# EAGLE design OpenSoundPhoton (EAGLE 7.5.0)
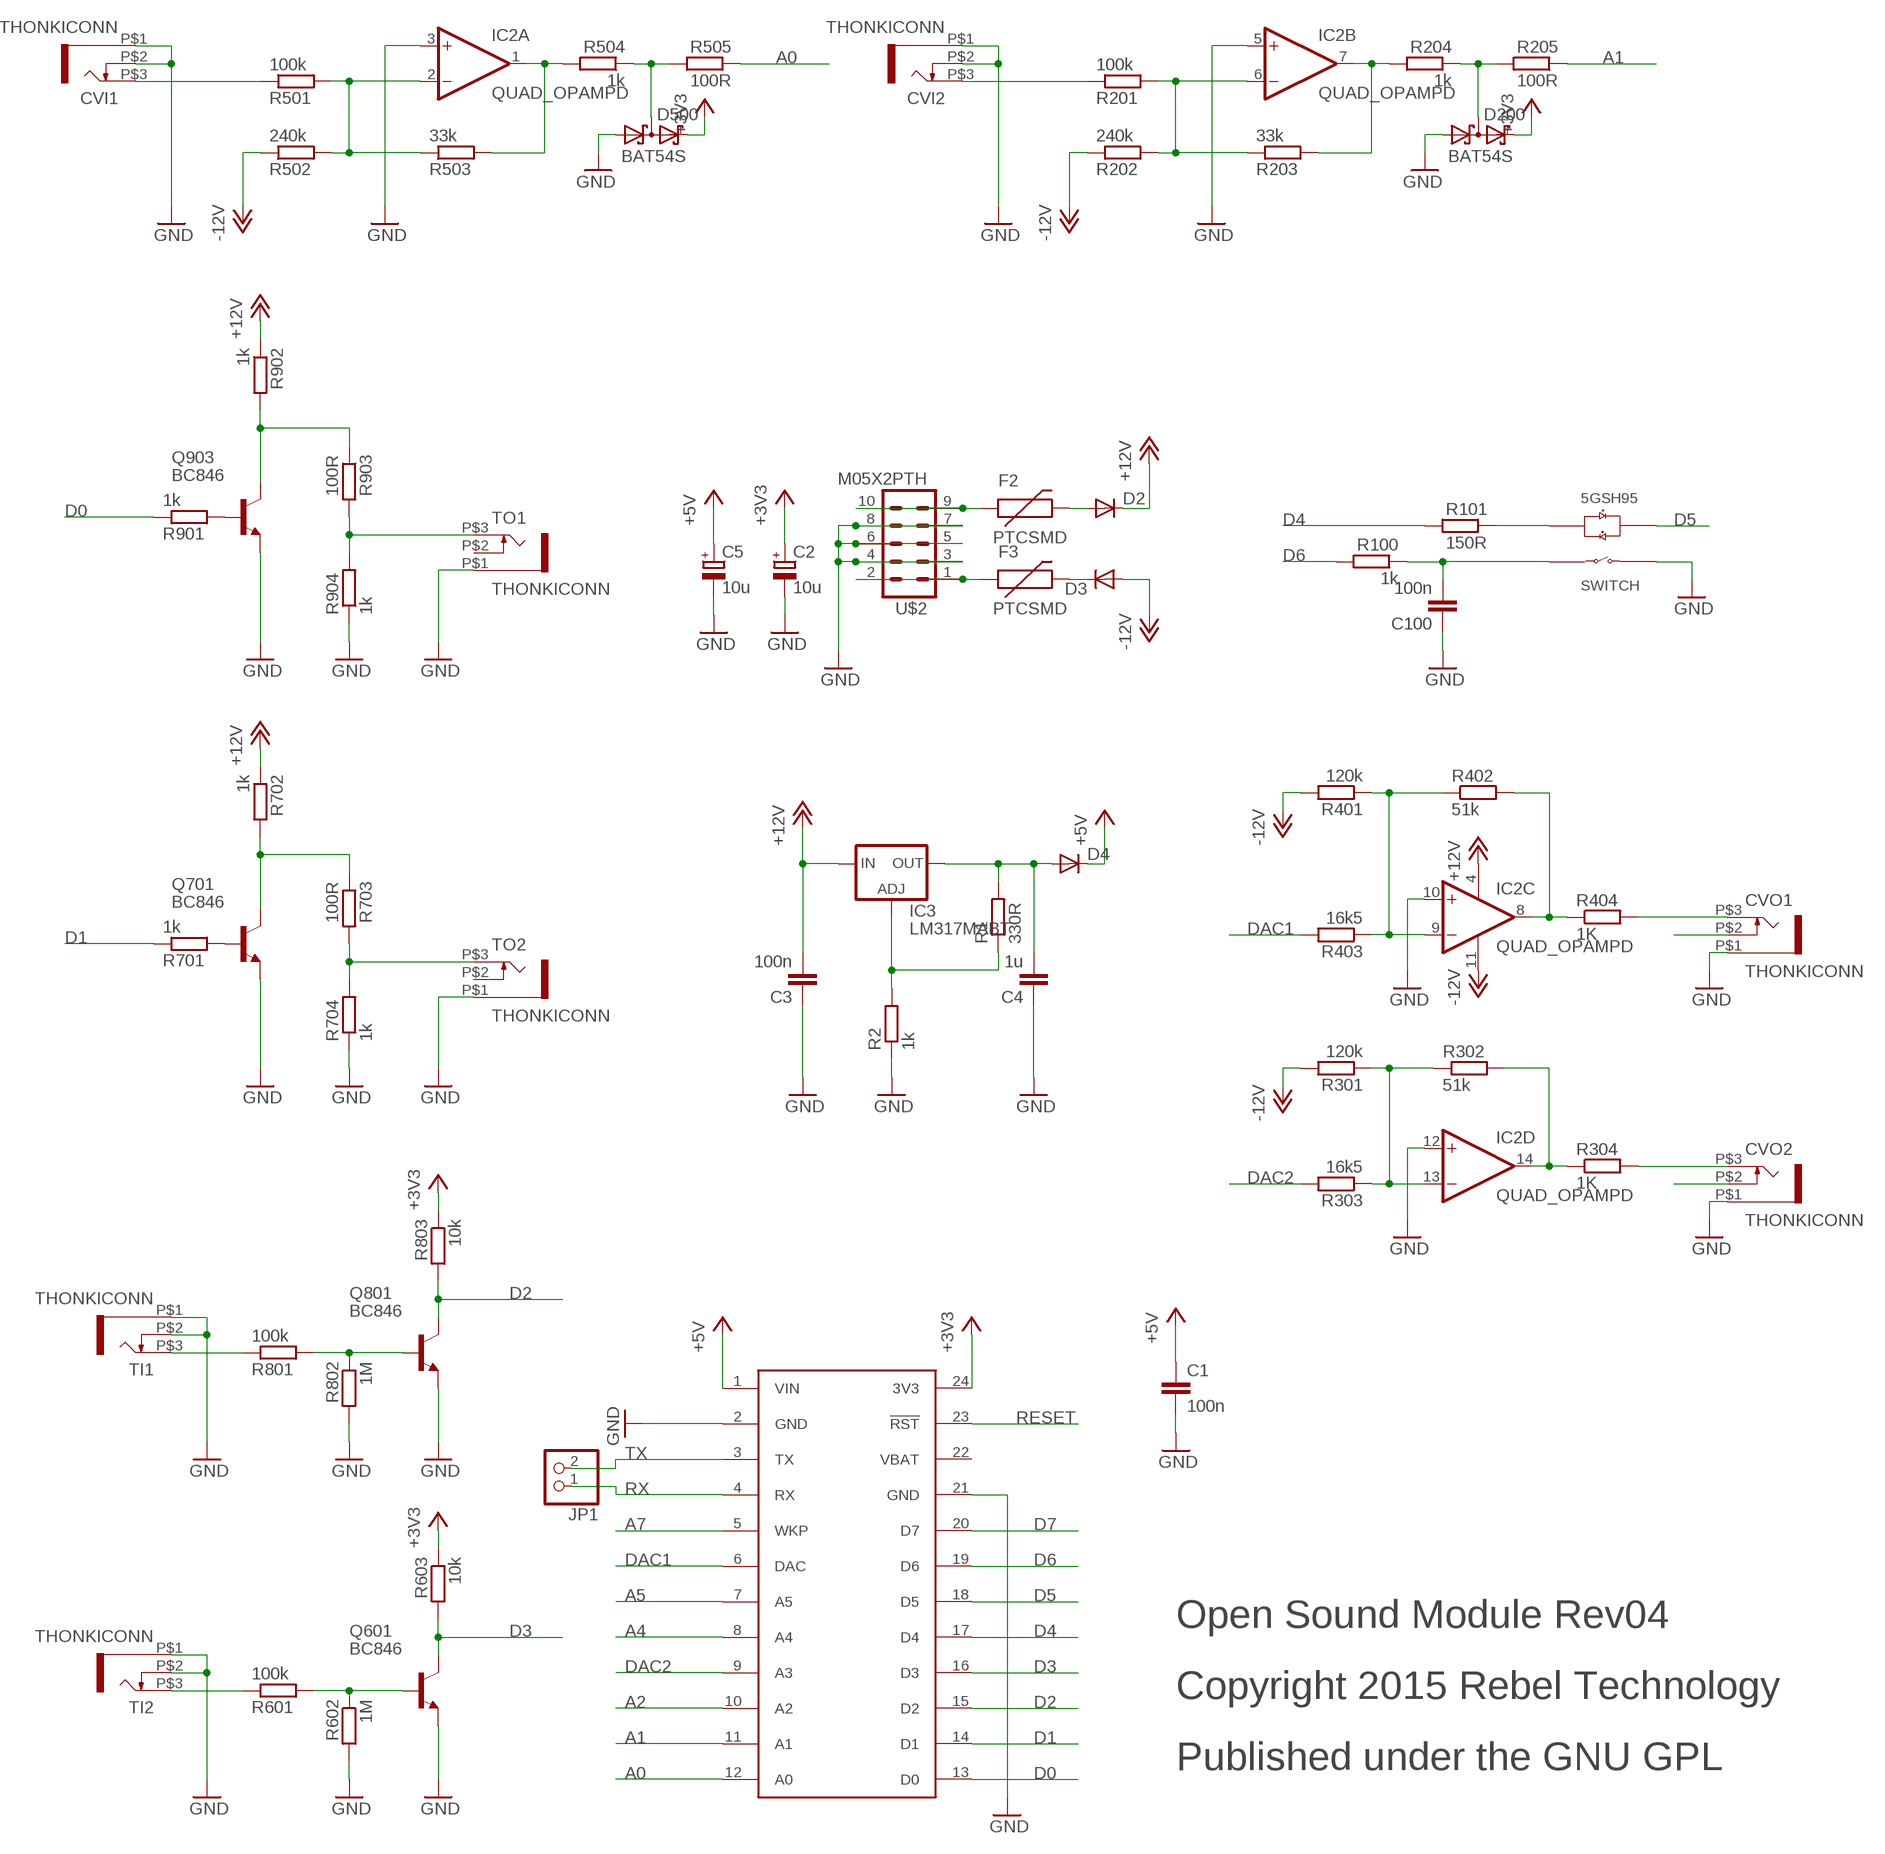
[diagram p0: schematic, sheet 1]

## Parts
C1  100n  C-EUC0603  [C0603]
C2  10u  CPOL-EUSANYO_SMD_A5  [SANYO-OSCON_SMD_A5]
C3  100n  C-EUC0603  [C0603]
C4  1u  C-EUC0603  [C0603]
C5  10u  CPOL-EUSANYO_SMD_A5  [SANYO-OSCON_SMD_A5]
C100  100n  C-EUC0603  [C0603]
CVI1  THONKICONN  [THONKICONN]
CVI2  THONKICONN  [THONKICONN]
CVO1  THONKICONN  [THONKICONN]
CVO2  THONKICONN  [THONKICONN]
D2  DIODESMA  [SMA-DIODE]
D3  DIODESMA  [SMA-DIODE]
D4  DIODESMA  [SMA-DIODE]
D200  BAT54S  [SOT23]
D500  BAT54S  [SOT23]
F2  PTCSMD  [PTC-1206]
F3  PTCSMD  [PTC-1206]
IC2  QUAD_OPAMPD  [SO14]
IC3  LM317MABT  [TO220L1]
JP1  PINHD-1X2  [1X02]
Q601  BC846  [SOT23]
Q701  BC846  [SOT23]
Q801  BC846  [SOT23]
Q903  BC846  [SOT23]
R1  330R  R-EU_0603  [0603]
R2  1k  R-EU_0603  [0603]
R100  1k  R-EU_0603  [0603]
R101  150R  R-EU_0603  [0603]
R201  100k  R-EU_0603  [0603]
R202  240k  R-EU_0603  [0603]
R203  33k  R-EU_0603  [0603]
R204  1k  R-EU_0603  [0603]
R205  100R  R-EU_0603  [0603]
R301  120k  R-EU_0603  [0603]
R302  51k  R-EU_0603  [0603]
R303  16k5  R-EU_0603  [0603]
R304  1K  R-EU_0603  [0603]
R401  120k  R-EU_0603  [0603]
R402  51k  R-EU_0603  [0603]
R403  16k5  R-EU_0603  [0603]
R404  1K  R-EU_0603  [0603]
R501  100k  R-EU_0603  [0603]
R502  240k  R-EU_0603  [0603]
R503  33k  R-EU_0603  [0603]
R504  1k  R-EU_0603  [0603]
R505  100R  R-EU_0603  [0603]
R601  100k  R-EU_0603  [0603]
R602  1M  R-EU_0603  [0603]
R603  10k  R-EU_0603  [0603]
R701  1k  R-EU_0603  [0603]
R702  1k  R-EU_0603  [0603]
R703  100R  R-EU_0603  [0603]
R704  1k  R-EU_0603  [0603]
R801  100k  R-EU_0603  [0603]
R802  1M  R-EU_0603  [0603]
R803  10k  R-EU_0603  [0603]
R901  1k  R-EU_0603  [0603]
R902  1k  R-EU_0603  [0603]
R903  100R  R-EU_0603  [0603]
R904  1k  R-EU_0603  [0603]
SPARK  SPARK_CORE  SPARK_CORECORE  [SPARK_CORE]
TI1  THONKICONN  [THONKICONN]
TI2  THONKICONN  [THONKICONN]
TO1  THONKICONN  [THONKICONN]
TO2  THONKICONN  [THONKICONN]
U$1  5GTH9  [5GTH9]
U$2  M05X2PTH  [AVR_ICSP]

## Nets
+3V3: C2.+ D200.2(C2) D500.2(C2) R603.1 R803.1 SPARK.24(3V3)
+5V: C1.1 C5.+ D4.C SPARK.1(VIN)
+12V: C3.2 D2.C IC2.4(P:V+) IC3.3(IN) R702.1 R902.1
-12V: D3.A IC2.11(P:V-) R202.1 R301.2 R401.2 R502.1
A0: R505.1 SPARK.12(A0)
A1: R205.1 SPARK.11(A1)
A2: SPARK.10(A2)
A4: SPARK.8(A4)
A5: SPARK.7(A5)
A7: SPARK.5(WKP)
D0: R901.1 SPARK.13(D0)
D1: R701.1 SPARK.14(D1)
D2: Q801.3(C) R803.2 SPARK.15(D2)
D3: Q601.3(C) R603.2 SPARK.16(D3)
D4: R101.2 SPARK.17(D4)
D5: SPARK.18(D5) U$1.+3(LED_R+)
D6: R100.2 SPARK.19(D6)
D7: SPARK.20(D7)
DAC1: R403.2 SPARK.6(DAC)
DAC2: R303.2 SPARK.9(A3)
GND: C1.2 C2.- C3.1 C4.1 C5.- C100.1 CVI1.P$1 CVI1.P$2 CVI2.P$1 CVI2.P$2 CVO1.P$1 CVO2.P$1 D200.1(A1) D500.1(A1) IC2.3(A:+IN) IC2.5(B:+IN) IC2.10(C:+IN) IC2.12(D:+IN) Q601.2(E) Q701.2(E) Q801.2(E) Q903.2(E) R2.1 R602.2 R704.1 R802.2 R904.1 SPARK.2(GND) SPARK.21(GND) TI1.P$1 TI1.P$2 TI2.P$1 TI2.P$2 TO1.P$1 TO2.P$1 U$1.1(SWITCH_B) U$2.3 U$2.4 U$2.5 U$2.6 U$2.7 U$2.8
N$1: R703.2 R704.2 TO2.P$3
N$2: Q903.1(B) R901.2
N$3: IC2.14(D:OUT) R302.2 R304.1
N$4: Q903.3(C) R902.2 R903.1
N$5: R903.2 R904.2 TO1.P$3
N$6: F3.1 U$2.1 U$2.2
N$7: IC2.8(C:OUT) R402.2 R404.1
N$8: CVO1.P$2
N$9: Q801.1(B) R801.2 R802.1
N$10: R801.1 TI1.P$3
N$11: CVI1.P$3 R501.1
N$13: IC2.9(C:-IN) R401.1 R402.1 R403.1
N$14: IC2.2(A:-IN) R501.2 R502.2 R503.1
N$15: IC2.13(D:-IN) R301.1 R302.1 R303.1
N$16: D500.3(C1A2) R504.1 R505.2
N$17: IC2.1(A:OUT) R503.2 R504.2
N$18: CVI2.P$3 R201.1
N$19: IC3.1(ADJ) R1.1 R2.2
N$20: IC2.6(B:-IN) R201.2 R202.2 R203.1
N$21: C4.2 D4.A IC3.2(OUT) R1.2
N$22: IC2.7(B:OUT) R203.2 R204.2
N$23: R601.1 TI2.P$3
N$24: D200.3(C1A2) R204.1 R205.2
N$25: D3.C F3.2
N$26: D2.A F2.2
N$27: Q601.1(B) R601.2 R602.1
N$28: R101.1 U$1.-2(LED_G+)
N$29: CVO2.P$2
N$31: CVO1.P$3 R404.2
N$32: CVO2.P$3 R304.2
N$34: Q701.1(B) R701.2
N$38: Q701.3(C) R702.2 R703.1
N$45: F2.1 U$2.9 U$2.10
RESET: SPARK.23(!RST)
RX: JP1.1 SPARK.4(RX)
SWITCH_A: C100.2 R100.1 U$1.4(SWITCH_A)
TX: JP1.2 SPARK.3(TX)
Unconnected: TO1.P$2 TO2.P$2

## Notes on the sheet
- Open Sound Module Rev04
- Copyright 2015 Rebel Technology
- Published under the GNU GPL

## Power pins joined to a net without a drawn wire
VBAT: SPARK.22(VBAT)

## Library data of the parts
C1 = resistor:C-EU: CAPACITOR, European symbol
C2 C5 = rcl:CPOL-EU: POLARIZED CAPACITOR, European symbol
C3 C4 C100 = rcl:C-EU: CAPACITOR, European symbol
CVI1 CVI2 CVO1 CVO2 TI1 TI2 TO1 TO2 = Rebel:THONKICONN
D2-D4 = SparkFun:DIODE: Diode These are standard reverse protection diodes and small signal diodes. SMA package can handle up to about 1A. SOD-323 can handle about 200mA. What the SOD-323 package when ordering, there are some mfgs out there that are 5-pin packages.
D200 D500 = diode:BAT54S: Schottky Diodes Pin connection corrected 2011-05-04 Source: Fairchild .. BAT54.pdf
F2 F3 = SparkFun:PTC: Resettable Fuse PTC Resettable Fuse. Spark Fun Electronics SKU : COM-08357
IC2 = adafruit:QUAD_OPAMP: OP AMP Standard quad package
IC3 = v-reg:LM317?*: 500 mA Adjustable Output Positive Voltage Regulator Source: http://www.onsemi.co.jp .. LM317M-D.PDF
JP1 = pinhead:PINHD-1X2: PIN HEADER
Q601 Q701 Q801 Q903 = transistor:BC846: NPN TRANSISTOR
R1 R2 R100 R101 R201-R205 R301-R304 R401-R404 R501-R505 R601-R603 R701-R704 R801-R803 R901-R904 = Rebel:R-EU_: RESISTOR, European symbol
SPARK = Spark:SPARK_CORE
U$1 = SWITCH-5GTH9:5GTH9
U$2 = SparkFun-Connectors:M05X2: Header 5x2 Standard 10-pin dual row 0.1" header. Commonly used with AVR-ISP. Use with Spark Fun Electronics SKU: PRT-00778

## Board
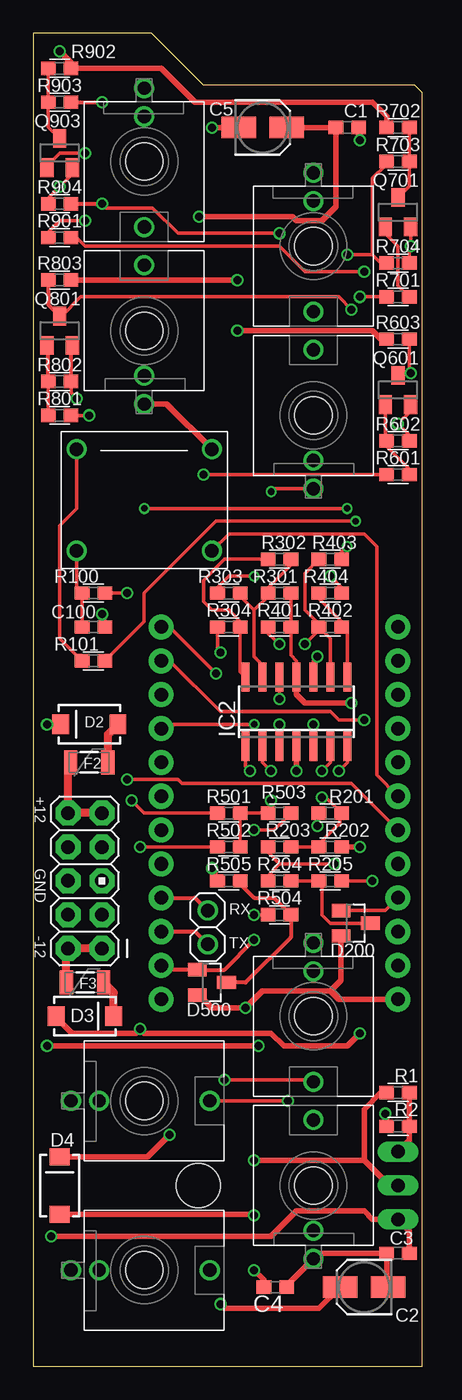
[diagram p1: board, top side]
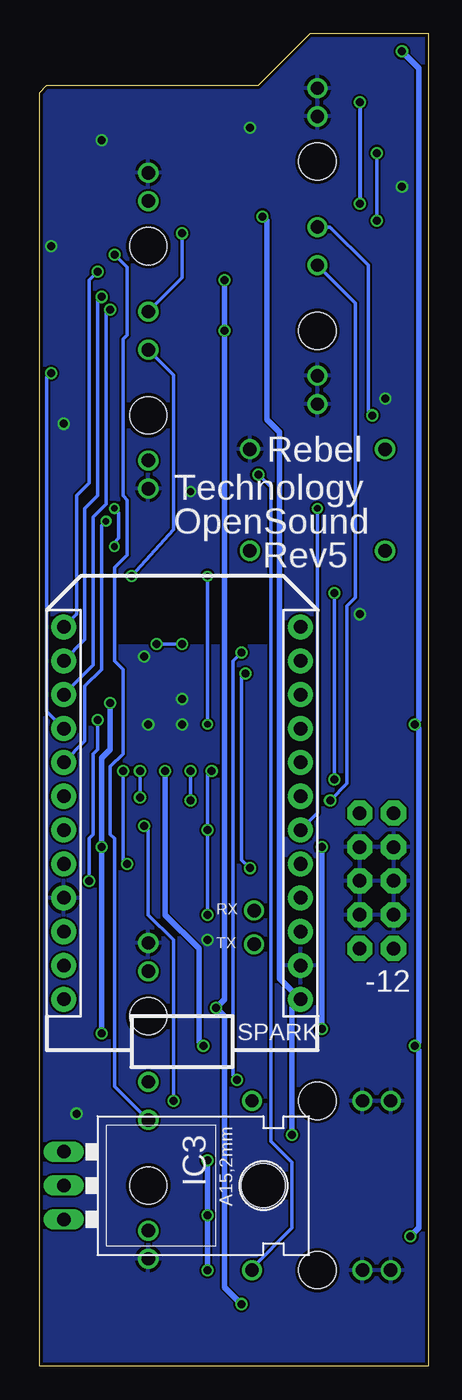
[diagram p2: board, bottom side, seen from below]

Size 29.2 x 100 mm. Coordinates in mm from the lower left corner, seen from the top.
Outline: 29.2,0 29.2,95.55 28.65,96.1 12.77,96.1 8.87,100 0,100 0,0 29.2,0
Copper layers (1*16): Top 0.035mm / dielectric 1.5mm / Bottom 0.035mm
Design rules "Fusion_eagle_rule_v1.1": minimum track width 6mil, minimum drill 12mil, track to track 6mil, track to pad 6mil, pad to pad 6mil, via to via 6mil, smd to smd 0mil, copper to edge 10mil, drill to drill 10mil, minimum pad ring 10mil, minimum via ring 6mil, stop-mask expansion 2mil, vias tented up to drill 100mil, thermal gap 10mil

### Footprints (pad centres in the part's own frame; a part is rotated, then mirrored left to right if it is on the bottom)
C0603 = smd 1.1 x 1: 1 -0.85,0; 2 0.85,0
SANYO-OSCON_SMD_A5 = smd 2.6 x 1.6: + 1.8,0; - -1.8,0
THONKICONN = drill 1: P$1 0,-5.5; P$2 0,-3.38; P$3 0,4.92 | hole 2.8: 0,0
SMA-DIODE = smd 1.27 x 1.47: A -2.15,0; C 2.15,0
SOT23 = smd 1 x 1.4: 1 -0.95,-1.1; 2 0.95,-1.1; 3 0,1.1
PTC-1206 = smd 1 x 1.8: 1 -1.4,0; 2 1.4,0
SO14 = smd 0.6 x 2.2: 1 -3.81,-2.6; 2 -2.54,-2.6; 3 -1.27,-2.6; 4 0,-2.6; 5 1.27,-2.6; 6 2.54,-2.6; 7 3.81,-2.6; 8 3.81,2.6; 9 2.54,2.6; 10 1.27,2.6; 11 0,2.6; 12 -1.27,2.6; 13 -2.54,2.6; 14 -3.81,2.6
TO220L1 = drill 1.016 long: 1 -2.54,-3.81; 2 0,-3.81; 3 2.54,-3.81 | hole 3.302: 0,11.176
1X02 = drill 1.016: 1 -1.27,0; 2 1.27,0
0603 = smd 1.1 x 1: 1 -0.85,0; 2 0.85,0
SPARK_CORE = drill 1.016 pad 1.88: 1 -8.89,13.97; 2 -8.89,11.43; 3 -8.89,8.89; 4 -8.89,6.35; 5 -8.89,3.81; 6 -8.89,1.27; 7 -8.89,-1.27; 8 -8.89,-3.81; 9 -8.89,-6.35; 10 -8.89,-8.89; 11 -8.89,-11.43; 12 -8.89,-13.97; 13 8.89,-13.97; 14 8.89,-11.43; 15 8.89,-8.89; 16 8.89,-6.35; 17 8.89,-3.81; 18 8.89,-1.27; 19 8.89,1.27; 20 8.89,3.81; 21 8.89,6.35; 22 8.89,8.89; 23 8.89,11.43; 24 8.89,13.97
5GTH9 = drill 1: 1 5.08,3.81; 4 -5.08,-3.81; +3 5.08,-3.81; -2 -5.08,3.81
AVR_ICSP = drill 1.016 pad 1.88 octagon: 1 -1.27,5.08; 2 1.27,5.08; 3 -1.27,2.54; 4 1.27,2.54; 5 -1.27,0; 6 1.27,0; 7 -1.27,-2.54; 8 1.27,-2.54; 9 -1.27,-5.08; 10 1.27,-5.08

### Placement (x,y rotation side)
C1  23.57,92.93 0 top
C2  24.84,5.93 180 top
C3  27.38,8.47 0 top
C4  18.17,5.93 180 top
C5  17.22,92.93 0 top
C100  4.52,55.46 180 top
CVI1  8.33,77.69 0 top
CVI2  8.33,19.9 270 top
CVO1  21.03,71.34 0 top
CVO2  21.03,26.25 180 top
D2  4.2,48.16 180 top
D3  3.88,26.25 0 top
D4  1.98,13.55 90 top
D200  24.2,33.24 270 top
D500  13.41,28.79 270 top
F2  4.2,45.3 0 top
F3  3.88,28.79 0 top
IC2  19.76,49.11 0 top
IC3  23.57,13.55 270 bottom
JP1  13.09,32.92 270 top
Q601  27.38,73.24 0 top
Q701  27.38,86.58 0 top
Q801  1.98,77.69 0 top
Q903  1.98,91.02 0 top
R1  27.38,20.54 180 top
R2  27.38,18 0 top
R100  4.52,58 0 top
R101  4.52,52.92 0 top
R201  22.3,41.49 0 top
R202  22.3,38.95 180 top
R203  18.49,38.95 180 top
R204  18.49,36.41 180 top
R205  22.3,36.41 180 top
R301  18.49,58 0 top
R302  18.49,60.54 180 top
R303  14.68,58 180 top
R304  14.68,55.46 180 top
R401  18.49,55.46 0 top
R402  22.3,55.46 0 top
R403  22.3,60.54 0 top
R404  22.3,58 0 top
R501  14.68,41.49 0 top
R502  14.68,38.95 0 top
R503  18.49,41.49 0 top
R504  18.49,33.87 180 top
R505  14.68,36.41 0 top
R601  27.38,66.89 0 top
R602  27.38,69.43 0 top
R603  27.38,77.05 0 top
R701  27.38,80.23 0 top
R702  27.38,92.93 0 top
R703  27.38,90.39 180 top
R704  27.38,82.77 180 top
R801  1.98,71.34 180 top
R802  1.98,73.88 0 top
R803  1.98,81.5 180 top
R901  1.98,84.67 180 top
R902  1.98,97.37 180 top
R903  1.98,94.83 0 top
R904  1.98,87.21 0 top
SPARK  18.49,41.49 180 bottom
TI1  8.33,90.39 180 top
TI2  8.33,7.2 270 top
TO1  21.03,84.04 180 top
TO2  21.03,13.55 0 top
U$1  8.33,64.99 0 top
U$2  3.88,36.41 180 top

### Tracks (layer width: path | path; a pad name or v marks a point on that pad's centre or on a via)
+3V3  (via drill 0.6)
  Top 0.406: R803.1 v15.31,81.5 | v14.04,4.66 14.36,4.34 21.45,4.34 C2.+ | R603.1 26.11,77.05 25.47,77.69 v15.31,77.69 | D200.2 23.1,28.96 22.3,28.16 | SPARK.24 22.93,27.52 22.3,28.16 | 22.3,28.16 17.22,28.16 v15.95,26.89 13.41,26.89 12.45,27.84 D500.2
  Bottom 0.406: v15.31,81.5 v15.31,77.69 15.31,27.52 v15.95,26.89 15.31,26.25 15.31,5.93 v14.04,4.66
+5V  (via drill 0.6)
  Top 0.406: D4.C 8.57,15.7 v10.23,17.36 | v12.45,86.26 19.44,86.26 19.76,85.94 21.66,85.94 22.72,87 C1.1 C5.+
  Bottom 0.406: v10.23,17.36 10.23,26.89 SPARK.1 11.19,29.11 11.19,70.07 12.14,71.02 12.14,85.94 v12.45,86.26
+12V  (via drill 0.6)
  Top 0.406: v1.98,98.64 2.61,98.01 | 2.61,98.01 2.61,97.59 R902.1 | R902.1 2.83,97.79 2.61,98.01 | v1.34,9.74 17.85,9.74 19.76,11.65 24.84,11.65 25.47,11.01 IC3.3 28.23,10.16 C3.2 | IC2.4 v19.76,44.67 | v16.9,24.03 v1.02,24.03 | D2.C v1.02,48.16 | R702.1 26.53,93.78 25.47,94.83 12.14,94.83 9.6,97.37 R902.1
  Bottom 0.406: v1.98,98.64 0.71,97.37 0.71,48.48 v1.02,48.16 0.71,47.84 0.71,24.35 v1.02,24.03 0.71,23.71 0.71,10.38 v1.34,9.74 | v19.76,44.67 19.76,33.87 17.22,31.33 17.22,24.35 v16.9,24.03
-12V  (via drill 0.6)
  Top 0.254: R301.2 R401.2 19.34,53.34 19.76,52.92 IC2.11 | R502.1 v8.01,38.95
  Top 0.406: IC2.11 19.76,50.38 20.39,49.75 v23.89,49.75 | v24.52,38.95 R202.1 | v24.52,24.98 23.57,24.03 18.8,24.03 17.85,24.98 8.33,24.98 v8.01,25.3 7.69,24.98 2.93,24.98 1.73,26.18 D3.A
  Bottom 0.406: v23.89,49.75 23.89,46.25 24.52,45.62 v24.52,38.95 v24.52,24.98 | v8.01,38.95 v8.01,25.3
A0  (via drill 0.6)
  Top 0.254: SPARK.12 10.23,55.46 v13.72,51.97 | v13.41,37.36 13.72,37.05 13.72,36.51 R505.1
  Bottom 0.254: v13.72,51.97 14.04,51.65 14.04,38 v13.41,37.36
A1  (via drill 0.6)
  Top 0.254: SPARK.11 10.23,52.92 14.04,49.11 22.3,49.11 22.93,48.48 v24.84,48.48 | v25.47,36.41 R205.1
  Bottom 0.254: v24.84,48.48 24.84,46.25 25.16,45.94 25.16,39.9 25.47,39.59 v25.47,36.41
D0  (via drill 0.6)
  Top 0.254: R901.1 3.25,84.67 3.88,84.04 18.49,84.04 20.39,82.13 v24.84,82.13
  Bottom 0.254: v24.84,82.13 25.47,81.5 25.47,66.26 26.43,65.3 26.43,56.41 SPARK.13
D1  (via drill 0.6)
  Top 0.254: R701.1 v24.52,80.23
  Bottom 0.254: SPARK.14 25.79,54.51 25.79,64.35 24.84,65.3 24.84,79.91 v24.52,80.23
D2  (via drill 0.6)
  Top 0.254: Q801.3 2.13,78.79 3.56,80.23 22.93,80.23 v23.89,79.27
  Top 0.305: R803.2 1.13,79.64 Q801.3
  Bottom 0.254: v23.89,79.27 24.2,78.96 24.2,64.67 25.16,63.72 25.16,52.6 SPARK.15
D3  (via drill 0.6)
  Top 0.254: Q601.3 27.55,74.51 v28.33,74.51 28.23,74.61 R603.2
  Bottom 0.254: SPARK.16 28.65,49.11 28.65,74.19 v28.33,74.51
D4  (via drill 0.5)
  Top 0.254: v24.2,63.4 13.72,63.4 8.33,58 8.33,55.88 R101.2
  Bottom 0.254: SPARK.17 25.79,46.89 25.79,51.02 24.52,52.29 24.52,63.08 v24.2,63.4
D5
  Top 0.254: SPARK.18 25.79,44.35 25.79,61.49 24.84,62.45 14.68,62.45 U$1.+3
D6  (via drill 0.6)
  Top 0.254: SPARK.19 23.89,43.71 11.19,43.71 10.87,44.03 v7.06,44.03 | v7.06,58 R100.2
  Bottom 0.254: v7.06,44.03 v7.06,58
DAC1  (via drill 0.5)
  Top 0.254: R403.2 23.15,61.07 v23.57,61.49 | v23.57,64.35 v8.33,64.35
  Bottom 0.254: v23.57,61.49 23.57,61.81 23.25,62.13 23.25,64.03 v23.57,64.35 | v8.33,64.35 8.33,41.49 SPARK.6
DAC2  (via drill 0.5)
  Top 0.254: R303.2 13.83,58.42 14.68,59.27 v16.58,59.27 | v16.58,48.16 9.92,48.16 SPARK.9
  Bottom 0.254: v16.58,59.27 v16.58,48.16
GND  (via drill 0.5, 0.6)
  Top 0.254: R802.2 2.83,73.03 v3.25,72.61 | 28.33,82.87 R704.1 28.23,83.93 v28.33,84.04 28.33,84.36 Q701.2 | Q601.2 28.33,71.65 v27.38,70.7 28.23,69.85 R602.2 | Q903.2 2.93,89.43 v1.98,88.48 1.13,87.63 R904.1 | D200.1 26.43,34.19 SPARK.21 | C100.1 5.37,56.2 v5.15,56.41 | IC2.10 21.03,52.92 v21.34,53.24 | IC2.12 v18.49,50.06 | CVO1.P$1 18.07,65.84 v17.85,65.62
  Top 0.305: R802.2 2.83,76.49 Q801.2 | SPARK.2 9.92,29.74 D500.1 14.36,29.74 v16.58,31.97
  Top 0.406: R2.1 26.53,18.85 v26.43,18.95 | C2.- 26.53,6.04 C3.1 21.45,8.47 TO2.P$1 19.02,6.04 C4.1 | IC2.3 v18.49,48.16 | IC2.5 v21.03,48.16 | CVI1.P$1 10.02,72.19 U$1.1 | C1.2 24.42,92.08 v24.52,91.97 | C5.- v13.41,92.93
  pour Bottom: 29.92,-1.69 -1.2,-1.69 -1.2,103.09 29.92,103.09
N$1  (via drill 0.6)
  Top 0.254: R704.2 26.11,82.77 25.47,83.4 | 25.47,83.4 v23.57,83.4 | R703.2 26.53,90.17 25.47,89.12 25.47,83.4
  Bottom 0.254: v23.57,83.4 22.62,82.45 22.62,77.37 22.93,77.05 22.93,65.3 22.62,64.99 22.62,60.86 23.57,59.91 23.57,52.92 22.93,52.29 22.93,45.94 23.89,44.98 23.89,39.9 23.57,39.59 23.57,21.01 TO2.P$3
N$2  (via drill 0.6)
  Top 0.254: 1.03,89.43 Q903.1 1.03,90.07 1.98,91.02 v3.88,91.02 | v3.88,85.94 1.98,85.94 1.13,85.09 R901.2
  Bottom 0.254: v3.88,91.02 v3.88,85.94
N$3
  Top 0.254: IC2.14 15.53,52.13 R304.1 15.53,55.88 14.68,56.73 13.41,56.73 12.77,57.37 12.77,58.95 14.36,60.54 R302.2
N$4
  Top 0.254: Q903.3 1.13,92.97 R903.1 R902.2
N$5  (via drill 0.6)
  Top 0.254: v5.15,87.21 5.47,86.89 8.96,86.89 10.87,84.99 v18.49,84.99
  Top 0.305: R904.2 v5.15,87.21 | R903.2 v5.15,94.83
  Bottom 0.254: v18.49,84.99 18.49,81.66 TO1.P$3
  Bottom 0.305: v5.15,94.83 v5.15,87.21
N$6
  Top 0.61: U$2.1 U$2.2 2.48,31.2 F3.1
N$7
  Top 0.254: R404.1 21.45,57.58 23.15,55.88 R402.2 23.57,55.04 IC2.8
N$9
  Top 0.254: R801.2 R802.1
  Top 0.305: R802.1 1.13,76.49 Q801.1
N$10  (via drill 0.6)
  Top 0.254: R801.1 v4.2,71.34
  Bottom 0.254: v4.2,71.34 4.52,71.65 4.52,82.61 7.38,85.47 TI1.P$3
N$11  (via drill 0.6)
  Top 0.254: R501.1 8.33,41.49 v7.37,42.44
  Bottom 0.254: CVI1.P$3 5.47,79.75 5.47,57.68 6.11,57.05 6.11,43.71 v7.37,42.44
N$13  (via drill 0.6)
  Top 0.254: R402.1 21.45,55.25 v20.39,54.19 | R401.1 17.64,54.93 v18.49,54.19 | R402.1 21.45,55.68 20.39,56.73 20.39,59.49 R403.1 | IC2.9 22.3,54.61 R402.1
  Bottom 0.254: v18.49,54.19 v20.39,54.19
N$14  (via drill 0.6)
  Top 0.254: R502.2 R501.2 R503.1 17.85,41.71 v17.85,42.44 | IC2.2 17.22,45.3 v17.85,44.67
  Bottom 0.254: v17.85,44.67 v17.85,42.44
N$15
  Top 0.254: R303.1 15.53,57.79 16.58,56.73 | 16.58,56.73 16.58,53.24 17.22,52.6 IC2.13 | R302.1 19.34,60.12 17.64,58.42 R301.1 17.64,57.79 16.58,56.73
N$16
  Top 0.305: R505.2 15.53,36.2 16.58,35.14 18.07,35.14 R504.1 19.34,32.18 15.95,28.79 D500.3
N$17  (via drill 0.6)
  Top 0.254: v16.58,40.22 18.07,40.22 R503.2 | IC2.1 15.95,44.98 v16.27,44.67 | v16.58,33.87 R504.2
  Bottom 0.254: v16.27,44.67 16.58,44.35 v16.58,40.22 v16.58,33.87
N$18  (via drill 0.6)
  Top 0.254: CVI2.P$3 v19.12,19.9 | v21.34,40.54 21.34,41.39 R201.1
  Bottom 0.254: v19.12,19.9 19.12,31.97 21.03,33.87 21.03,40.22 v21.34,40.54
N$19
  Top 0.406: R1.1 R2.2 28.23,16.94 IC3.1
N$20  (via drill 0.6)
  Top 0.254: 21.66,39.17 R202.2 | R202.2 21.45,39.17 23.03,40.75 23.03,41.38 R201.2 21.98,42.66 v21.66,42.66 | IC2.6 22.3,45.3 v21.66,44.67 | R203.1 R202.2
  Bottom 0.254: v21.66,44.67 v21.66,42.66
N$21  (via drill 0.6)
  Top 0.406: IC3.2 26.74,13.55 24.84,15.46 | 24.84,15.46 v16.58,15.46 | D4.A 16.51,11.4 v16.58,11.33 | R1.2 26.11,20.54 24.84,19.27 24.84,15.46 | C4.2 17.32,6.46 v16.58,7.2
  Bottom 0.406: v16.58,15.46 v16.58,11.33 v16.58,7.2
N$22  (via drill 0.6)
  Top 0.254: R204.2 17.64,36.83 18.49,37.68 | IC2.7 23.57,45.3 v22.93,44.67 | v22.62,37.68 18.49,37.68 | R203.2 17.64,38.53 18.49,37.68
  Bottom 0.254: v22.93,44.67 22.93,38 v22.62,37.68
N$23  (via drill 0.6)
  Top 0.254: R601.1 v12.77,66.89
  Bottom 0.254: v12.77,66.89 11.82,65.94 11.82,16.88 10.23,15.3 10.23,10.38 13.25,7.36 TI2.P$3
N$24
  Top 0.254: R204.1 R205.2 21.66,36.2 21.66,33.87 22.3,33.24 D200.3
N$25
  Top 0.61: D3.C 6.03,28.04 F3.2
N$26
  Top 0.61: F2.2 5.6,47.41 D2.A
N$27
  Top 0.254: Q601.1 26.43,69.53 R602.1 26.53,69.01 28.23,67.31 R601.2
N$28
  Top 0.254: U$1.-2 3.25,64.35 1.98,63.08 1.98,54.61 R101.1
N$31  (via drill 0.6)
  Top 0.254: R404.2 23.15,58.42 v22.3,59.27
  Bottom 0.254: v22.3,59.27 19.12,62.76 19.12,74.35 CVO1.P$3
N$32  (via drill 0.6)
  Top 0.254: R304.2 13.83,53.77 v14.04,53.56 | v14.36,21.49 20.87,21.49 CVO2.P$3
  Bottom 0.254: v14.04,53.56 14.68,52.92 14.68,21.81 v14.36,21.49
N$34
  Top 0.254: Q701.1 26.43,84.99 27.38,84.04 27.38,81.08 R701.2
N$38
  Top 0.254: R702.2 R703.1 28.23,88.53 Q701.3
N$45
  Top 0.61: U$2.9 U$2.10 2.61,44.85 F2.1
RX
  Top 0.305: SPARK.4 12.14,35.14 JP1.1
SWITCH_A
  Top 0.254: U$1.4 3.25,58.42 R100.1 C100.2
TX
  Top 0.305: SPARK.3 12.14,32.6 JP1.2

### Text on the board
tPlace: +12 | GND | RX | -12 | TX
bPlace: Rebel | Technology | OpenSound | Rev5 | RX | TX | -12